# Altium schematic sheet [05] - POWER REGULATION.SchDoc
size A3; DocumentNumber: 3; SheetNumber: 3; SheetTotal: 4
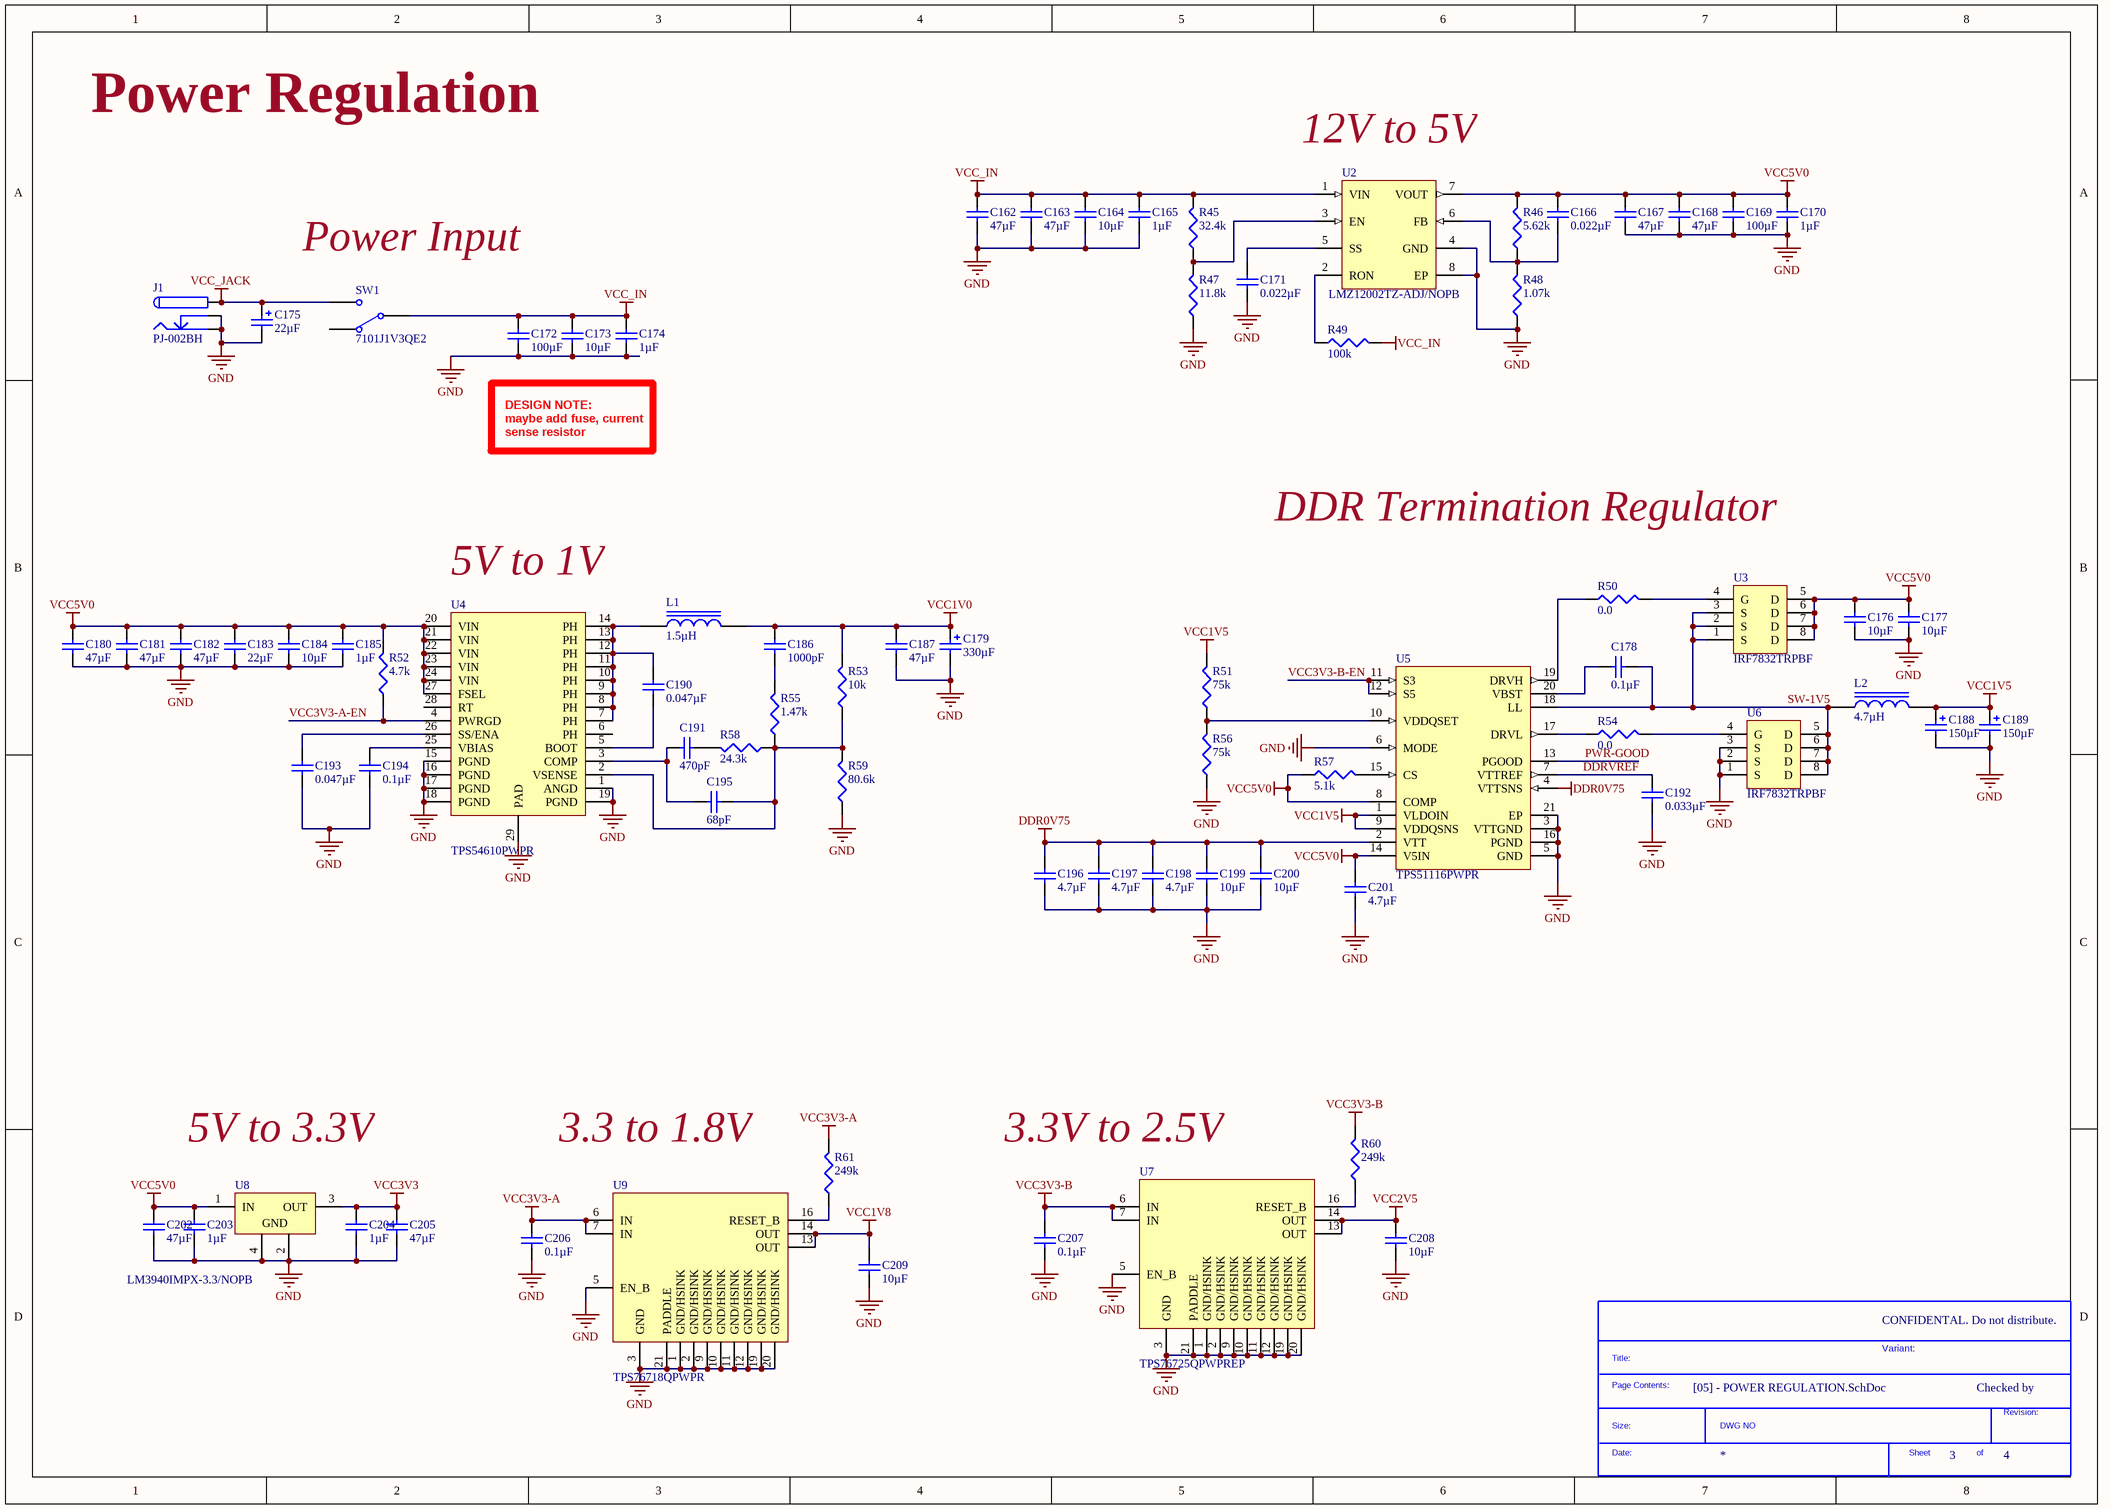
[diagram p0: [05] - POWER REGULATION.SchDoc]

## Parts
*  SDTitleBlock  (value not drawn)  (graphical)
C162  Capacitance: 47µF  [CAP-1210]  (hidden comment: GRM32ER61C476ME15L)
C163  Capacitance: 47µF  [CAP-1210]  (hidden comment: GRM32ER61C476ME15L)
C164  Capacitance: 10µF  [CAP-0805]  (hidden comment: GRM21BR61E106KA73L)
C165  Capacitance: 1µF  [CAP-0603]  (hidden comment: GRM188R71C105KA12D)
C166  Capacitance: 0.022µF  [CAP-0402]  (hidden comment: C1005X7R1E223K050BB)
C167  Capacitance: 47µF  [CAP-1210]  (hidden comment: GRM32ER61C476ME15L)
C168  Capacitance: 47µF  [CAP-1210]  (hidden comment: GRM32ER61C476ME15L)
C169  Capacitance: 100µF  [CAP-1210]  (hidden comment: GRM32EE70G107ME19L)
C170  Capacitance: 1µF  [CAP-0603]  (hidden comment: GRM188R71C105KA12D)
C171  Capacitance: 0.022µF  [CAP-0402]  (hidden comment: C1005X7R1E223K050BB)
C172  Capacitance: 100µF  [CAP-1210]  (hidden comment: GRM32EE70G107ME19L)
C173  Capacitance: 10µF  [CAP-0805]  (hidden comment: GRM21BR61E106KA73L)
C174  Capacitance: 1µF  [CAP-0603]  (hidden comment: GRM188R71C105KA12D)
C175  Capacitance: 22µF  [CAP_POL_1210]  (hidden comment: TAJB226K020RNJ)
C176  Capacitance: 10µF  [CAP-0805]  (hidden comment: GRM21BR61E106KA73L)
C177  Capacitance: 10µF  [CAP-0805]  (hidden comment: GRM21BR61E106KA73L)
C178  Capacitance: 0.1µF  [CAP-0402]  (hidden comment: CGA2B1X7R1C104K050BC)
C179  Capacitance: 330µF  [CAP_POL_2917]  (hidden comment: T530X337M010ATE004)
C180  Capacitance: 47µF  [CAP-1210]  (hidden comment: GRM32ER61C476ME15L)
C181  Capacitance: 47µF  [CAP-1210]  (hidden comment: GRM32ER61C476ME15L)
C182  Capacitance: 47µF  [CAP-1210]  (hidden comment: GRM32ER61C476ME15L)
C183  Capacitance: 22µF  [CAP-0805]  (hidden comment: GRM21BR61A226ME51L)
C184  Capacitance: 10µF  [CAP-0805]  (hidden comment: GRM21BR61E106KA73L)
C185  Capacitance: 1µF  [CAP-0603]  (hidden comment: GRM188R71C105KA12D)
C186  Capacitance: 1000pF  [CAP-0402]  (hidden comment: CGA2B2X7R1H102K050BA)
C187  Capacitance: 47µF  [CAP-1210]  (hidden comment: GRM32ER61C476ME15L)
C188  Capacitance: 150µF  (hidden comment: TCJB157M006R0070)
C189  Capacitance: 150µF  (hidden comment: TCJB157M006R0070)
C190  Capacitance: 0.047µF  [CAP-0402]  (hidden comment: CGA2B1X7R1E473K050BC)
C191  Capacitance: 470pF  [CAP-0402]  (hidden comment: CGA2B2X8R1H471K050BA)
C192  Capacitance: 0.033µF  [CAP-0402]  (hidden comment: CGA2B3X7R1H333K050BB)
C193  Capacitance: 0.047µF  [CAP-0402]  (hidden comment: CGA2B1X7R1E473K050BC)
C194  Capacitance: 0.1µF  [CAP-0402]  (hidden comment: CGA2B1X7R1C104K050BC)
C195  Capacitance: 68pF  [CAP-0402]  (hidden comment: CGA2B2C0G1H680J050BA)
C196  Capacitance: 4.7µF  [CAP-0603]  (hidden comment: GRM188R60J475KE19D)
C197  Capacitance: 4.7µF  [CAP-0603]  (hidden comment: GRM188R60J475KE19D)
C198  Capacitance: 4.7µF  [CAP-0603]  (hidden comment: GRM188R60J475KE19D)
C199  Capacitance: 10µF  [CAP-0805]  (hidden comment: GRM21BR61E106KA73L)
C200  Capacitance: 10µF  [CAP-0805]  (hidden comment: GRM21BR61E106KA73L)
C201  Capacitance: 4.7µF  [CAP-0805]  (hidden comment: CGA4J3X7R1C475K125AB)
C202  Capacitance: 47µF  [CAP-1210]  (hidden comment: GRM32ER61C476ME15L)
C203  Capacitance: 1µF  [CAP-0603]  (hidden comment: GRM188R71C105KA12D)
C204  Capacitance: 1µF  [CAP-0603]  (hidden comment: GRM188R71C105KA12D)
C205  Capacitance: 47µF  [CAP-1210]  (hidden comment: GRM32ER61C476ME15L)
C206  Capacitance: 0.1µF  [CAP-0402]  (hidden comment: CGA2B1X7R1C104K050BC)
C207  Capacitance: 0.1µF  [CAP-0402]  (hidden comment: CGA2B1X7R1C104K050BC)
C208  Capacitance: 10µF  [CAP-0805]  (hidden comment: GRM21BR61E106KA73L)
C209  Capacitance: 10µF  [CAP-0805]  (hidden comment: GRM21BR61E106KA73L)
J1  PJ-002BH  [PJ-002BH]
L1  Inductance: 1.5µH  [INDP9898X51N]  (hidden comment: SRU1048-1R5Y)
L2  Inductance: 4.7µH  [INDP9898X51N]  (hidden comment: SRU1048-4R7Y)
R45  Resistance (Ohms): 32.4k  [R0402]  (hidden comment: ERJ-2RKF3242X)
R46  Resistance (Ohms): 5.62k  [R0402]  (hidden comment: ERJ-2RKF5621X)
R47  Resistance (Ohms): 11.8k  [R0402]  (hidden comment: ERJ-2RKF1182X)
R48  Resistance (Ohms): 1.07k  [R0402]  (hidden comment: ERJ-2RKF1071X)
R49  Resistance (Ohms): 100k  [R0402]  (hidden comment: ERJ-2RKF1003X)
R50  Resistance (Ohms): 0.0  [R0402]  (hidden comment: ERJ-2GE0R00X)
R51  Resistance (Ohms): 75k  [R0402]  (hidden comment: ERJ-2RKF7502X)
R52  Resistance (Ohms): 4.7k  [R0603]  (hidden comment: ERJ-3EKF4701V)
R53  Resistance (Ohms): 10k  [R0402]  (hidden comment: RC0402FR-0710KL)
R54  Resistance (Ohms): 0.0  [R0402]  (hidden comment: ERJ-2GE0R00X)
R55  Resistance (Ohms): 1.47k  [R0402]  (hidden comment: ERA-2AEB1471X)
R56  Resistance (Ohms): 75k  [R0402]  (hidden comment: ERJ-2RKF7502X)
R57  Resistance (Ohms): 5.1k  [R0402]  (hidden comment: CRCW04025K10FKED)
R58  Resistance (Ohms): 24.3k  [R0402]  (hidden comment: ERJ-2RKF2432X)
R59  Resistance (Ohms): 80.6k  [R0402]  (hidden comment: ERA-2AEB8062X)
R60  Resistance (Ohms): 249k  [R0402]  (hidden comment: ERJ-2RKF2493X)
R61  Resistance (Ohms): 249k  [R0402]  (hidden comment: ERJ-2RKF2493X)
SW1  7101J1V3QE2  [SPDT]
U2  LMZ12002TZ-ADJ/NOPB  [TZA07A_V]
U3  IRF7832TRPBF  [SOIC127P600X175-8N]
U4  TPS54610PWPR  [TSOP65P640X120_HS-29N]
U5  TPS51116PWPR  [TSOP65P640X120_HS-21N]
U6  IRF7832TRPBF  [SOIC127P600X175-8N]
U7  TPS76725QPWPREP  [TSOP65P640X120_HS-21N]
U8  LM3940IMPX-3.3/NOPB  [SOT230P700X180-4N]
U9  TPS76718QPWPR  [TSOP65P640X120_HS-21N]

## Nets
DDR0V75: C196.1 C197.1 C198.1 C199.1 C200.1 U5.2(VTT) U5.4(VTTSNS)
GND: C162.2 C163.2 C164.2 C165.2 C167.2 C168.2 C169.2 C170.2 C171.2 C172.2 C173.2 C174.2 C175.2 C176.2 C177.2 C179.1 C180.2 C181.2 C182.2 C183.2 C184.2 C185.2 C187.2 C188.2 C189.2 C192.2 C193.2 C194.2 C196.2 C197.2 C198.2 C199.2 C200.2 C201.2 C202.1 C203.1 C204.1 C205.1 C206.2 C207.2 C208.2 C209.2 J1.2 J1.3 R47.1 R48.1 R56.1 R59.1 U2.4(GND) U2.8(EP) U4.1(ANGD) U4.15(PGND) U4.16(PGND) U4.17(PGND) U4.18(PGND) U4.19(PGND) U4.29(PAD) U5.3(VTTGND) U5.5(GND) U5.6(MODE) U5.16(PGND) U5.21(EP) U6.1(S) U6.2(S) U6.3(S) U7.1(GND/HSINK) U7.2(GND/HSINK) U7.3(GND) U7.5(EN_B) U7.9(GND/HSINK) U7.10(GND/HSINK) U7.11(GND/HSINK) U7.12(GND/HSINK) U7.19(GND/HSINK) U7.20(GND/HSINK) U7.21(PADDLE) U8.2(GND) U8.4(GND) U9.1(GND/HSINK) U9.2(GND/HSINK) U9.3(GND) U9.5(EN_B) U9.9(GND/HSINK) U9.10(GND/HSINK) U9.11(GND/HSINK) U9.12(GND/HSINK) U9.19(GND/HSINK) U9.20(GND/HSINK) U9.21(PADDLE)
VCC1V0: C179.2 C186.1 C187.1 L1.2 R53.2
VCC1V5: C188.1 C189.1 L2.2 R51.2 U5.1(VLDOIN) U5.9(VDDQSNS)
VCC1V8: C209.1 U9.13(OUT) U9.14(OUT)
VCC2V5: C208.1 U7.13(OUT) U7.14(OUT)
VCC3V3: C204.2 C205.2 U8.3(OUT)
VCC3V3-A: C206.1 R61.2 U9.6(IN) U9.7(IN)
VCC3V3-B: C207.1 R60.2 U7.6(IN) U7.7(IN)
VCC5V0: C166.1 C167.1 C168.1 C169.1 C170.1 C176.1 C177.1 C180.1 C181.1 C182.1 C183.1 C184.1 C185.1 C201.1 C202.2 C203.2 R46.2 R52.2 R57.1 U2.7(VOUT) U3.5(D) U3.6(D) U3.7(D) U3.8(D) U4.20(VIN) U4.21(VIN) U4.22(VIN) U4.23(VIN) U4.24(VIN) U4.27(FSEL) U5.8(COMP) U5.14(V5IN) U8.1(IN)
VCC_IN: C162.1 C163.1 C164.1 C165.1 C172.1 C173.1 C174.1 R45.2 R49.2 SW1.2 U2.1(VIN)
VCC_JACK: C175.1 J1.1 SW1.1
DDRVREF: C192.1 U5.7(VTTREF)
PWR-GOOD: U5.13(PGOOD)
SW-1V5: C178.1 L2.1 U3.1(S) U3.2(S) U3.3(S) U5.18(LL) U6.5(D) U6.6(D) U6.7(D) U6.8(D)
VCC3V3-A-EN: R52.1 U4.4(PWRGD)
VCC3V3-B-EN: U5.11(S3) U5.12(S5)
NetC166_2: C166.2 R46.1 R48.2 U2.6(FB)
NetC171_1: C171.1 U2.5(SS)
NetC178_2: C178.2 U5.20(VBST)
NetC186_2: C186.2 R55.2
NetC190_1: C190.1 L1.1 U4.7(PH) U4.8(PH) U4.9(PH) U4.10(PH) U4.11(PH) U4.12(PH) U4.13(PH) U4.14(PH)
NetC190_2: C190.2 U4.5(BOOT)
NetC191_1: C191.1 R58.2
NetC191_2: C191.2 C195.2 U4.3(COMP)
NetC193_1: C193.1 U4.26(SS/ENA)
NetC194_1: C194.1 U4.25(VBIAS)
NetC195_1: C195.1 R53.1 R55.1 R58.1 R59.2 U4.2(VSENSE)
NetR45_1: R45.1 R47.2 U2.3(EN)
NetR49_1: R49.1 U2.2(RON)
NetR50_1: R50.1 U5.19(DRVH)
NetR50_2: R50.2 U3.4(G)
NetR51_1: R51.1 R56.2 U5.10(VDDQSET)
NetR54_1: R54.1 U5.17(DRVL)
NetR54_2: R54.2 U6.4(G)
NetR57_2: R57.2 U5.15(CS)
NetR60_1: R60.1 U7.16(RESET_B)
NetR61_1: R61.1 U9.16(RESET_B)

Not connected (* = marked no-connect by the designer): SW1 3; U4 6(PH) 28(RT)

## Notes on the sheet
- Power Regulation
- 12V to 5V
- (near SW1) Power Input
- DESIGN NOTE:
  maybe add fuse, current sense resistor
- 5V to 1V
- DDR Termination Regulator
- 5V to 3.3V
- (near R61) 3.3 to 1.8V
- 3.3V to 2.5V
- CONFIDENTAL. Do not distribute.
- Variant:
- Checked by
- (in symbol SDTitleBlock) Title:; Page Contents:; Revision:; Size:; DWG NO; Date:; Sheet; of

## Library data of the parts
C162 C163 C167 C168 C180-C182 C187 C202 C205 = GRM32ER61C476ME15L: CAP CER 47UF 16V X5R 1210; Manufacturer: Murata Electronics North America; Tolerance: ±20%; Supplier 1: Digi-Key; Manufacturer Part Number: GRM32ER61C476ME15L; RoHS: RoHS Compliant; Category: Capacitors; Stock 1: 466196; Pricing 1: 1=0.94, 10=0.795, 50=0.585, 100=0.465, 250=0.39, 500=0.3525 (USD); Packaging: Cut Tape (CT); Voltage - Rated: 16V; Temperature Coefficient: X5R; Mounting Type: Surface Mount, MLCC; Operating Temperature: -55°C ~ 85°C; Applications: General Purpose; Ratings: -; Package / Case: 1210 (3225 Metric); Size / Dimension: 0.126" L x 0.098" W (3.20mm x 2.50mm); Height - Seated (Max): -; Thickness (Max): 0.106" (2.70mm); Lead Spacing: -; Features: -; Lead Style: -; ComponentLink1URL: http://www.murata.com/~/media/webrenewal/support/library/catalog/products/capacitor/mlcc/c02e.pdf; ComponentLink1Description: http://www.murata.com/~/media/webrenewal/support/library/catalog/products/capacitor/mlcc/c02e.pdf; Supplier Part Number 1: 490-3888-1-ND
C164 C173 C176 C177 C184 C199 C200 C208 C209 = GRM21BR61E106KA73L: CAP CER 10UF 25V X5R 0805; Manufacturer: Murata Electronics North America; Tolerance: ±10%; Supplier 1: Digi-Key; Manufacturer Part Number: GRM21BR61E106KA73L; RoHS: RoHS Compliant; Category: Capacitors; Stock 1: 242003; Pricing 1: 1=0.2, 10=0.136, 50=0.0826, 100=0.0693 (USD); Packaging: Cut Tape (CT); Voltage - Rated: 25V; Temperature Coefficient: X5R; Mounting Type: Surface Mount, MLCC; Operating Temperature: -55°C ~ 85°C; Applications: General Purpose; Ratings: -; Package / Case: 0805 (2012 Metric); Size / Dimension: 0.079" L x 0.049" W (2.00mm x 1.25mm); Height - Seated (Max): -; Thickness (Max): 0.053" (1.35mm); Lead Spacing: -; Features: -; Lead Style: -; ComponentLink1URL: http://www.murata.com/~/media/webrenewal/support/library/catalog/products/capacitor/mlcc/c02e.pdf; ComponentLink1Description: http://www.murata.com/~/media/webrenewal/support/library/catalog/products/capacitor/mlcc/c02e.pdf; Supplier Part Number 1: 490-5523-1-ND
C165 C170 C174 C185 C203 C204 = GRM188R71C105KA12D: CAP CER 1UF 16V X7R 0603; Manufacturer: Murata Electronics North America; Tolerance: ±10%; Supplier 1: Digi-Key; Manufacturer Part Number: GRM188R71C105KA12D; RoHS: RoHS Compliant; Category: Capacitors; Stock 1: 819049; Pricing 1: 1=0.1, 10=0.073, 50=0.0396, 100=0.0336, 250=0.02744, 500=0.02348, 1000=0.0183 (USD); Packaging: Cut Tape (CT); Voltage - Rated: 16V; Temperature Coefficient: X7R; Mounting Type: Surface Mount, MLCC; Operating Temperature: -55°C ~ 125°C; Applications: General Purpose; Ratings: -; Package / Case: 0603 (1608 Metric); Size / Dimension: 0.063" L x 0.031" W (1.60mm x 0.80mm); Height - Seated (Max): -; Thickness (Max): 0.035" (0.90mm); Lead Spacing: -; Features: -; Lead Style: -; ComponentLink1URL: http://www.murata.com/~/media/webrenewal/support/library/catalog/products/capacitor/mlcc/c02e.pdf; ComponentLink1Description: http://www.murata.com/~/media/webrenewal/support/library/catalog/products/capacitor/mlcc/c02e.pdf; Supplier Part Number 1: 490-3900-1-ND
C166 C171 = C1005X7R1E223K050BB: CAP CER 0.022UF 25V X7R 0402; Manufacturer: TDK Corporation; Tolerance: ±10%; Supplier 1: Digi-Key; Manufacturer Part Number: C1005X7R1E223K050BB; RoHS: RoHS Compliant; Category: Capacitors; Stock 1: 573981; Pricing 1: 1=0.1, 10=0.032, 100=0.0149, 250=0.01216, 500=0.0104, 1000=0.0081, 5000=0.00675 (USD); Packaging: Cut Tape (CT); Voltage - Rated: 25V; Temperature Coefficient: X7R; Mounting Type: Surface Mount, MLCC; Operating Temperature: -55°C ~ 125°C; Applications: General Purpose; Ratings: -; Package / Case: 0402 (1005 Metric); Size / Dimension: 0.039" L x 0.020" W (1.00mm x 0.50mm); Height - Seated (Max): -; Thickness (Max): 0.022" (0.55mm); Lead Spacing: -; Features: -; Lead Style: -; ComponentLink1URL: https://product.tdk.com/info/en/catalog/datasheets/mlcc_commercial_general_en.pdf; ComponentLink1Description: https://product.tdk.com/info/en/catalog/datasheets/mlcc_commercial_general_en.pdf; Supplier Part Number 1: 445-1261-1-ND
C169 C172 = GRM32EE70G107ME19L: CAP CER 100UF 4V X7U 1210; Manufacturer: Murata Electronics North America; Tolerance: ±20%; Supplier 1: Digi-Key; Manufacturer Part Number: GRM32EE70G107ME19L; RoHS: RoHS Compliant; Category: Capacitors; Stock 1: 21753; Pricing 1: 1=1.45, 10=1.189, 50=1.0444, 100=0.8413, 250=0.69624, 500=0.62372 (USD); Packaging: Cut Tape (CT); Voltage - Rated: 4V; Temperature Coefficient: X7U; Mounting Type: Surface Mount, MLCC; Operating Temperature: -55°C ~ 125°C; Applications: General Purpose; Ratings: -; Package / Case: 1210 (3225 Metric); Size / Dimension: 0.126" L x 0.098" W (3.20mm x 2.50mm); Height - Seated (Max): -; Thickness (Max): 0.106" (2.70mm); Lead Spacing: -; Features: -; Lead Style: -; ComponentLink1URL: http://www.murata.com/~/media/webrenewal/support/library/catalog/products/capacitor/mlcc/c02e.pdf; ComponentLink1Description: http://www.murata.com/~/media/webrenewal/support/library/catalog/products/capacitor/mlcc/c02e.pdf; Supplier Part Number 1: 490-6534-1-ND
C175 = TAJB226K020RNJ: CAP TANT 22UF 20V 10% 1210; Manufacturer: AVX Corporation; Manufacturer Size Code: B; ESR (Equivalent Series Resistance): 1.8 Ohm; Type: Molded; Supplier 1: Digi-Key; Manufacturer Part Number: TAJB226K020RNJ; RoHS: RoHS Compliant; Category: Capacitors; Stock 1: 649792; Pricing 1: 1=0.88, 10=0.838, 100=0.4063, 250=0.33752, 500=0.30626, 1000=0.28125 (USD); Packaging: Cut Tape (CT); Tolerance: ±10%; Voltage - Rated: 20V; Operating Temperature: -55°C ~ 125°C; Mounting Type: Surface Mount; Package / Case: 1210 (3528 Metric); Size / Dimension: 0.138" L x 0.110" W (3.50mm x 2.80mm); Height - Seated (Max): 0.083" (2.10mm); Lead Spacing: -; Features: General Purpose; Lifetime @ Temp.: -; ComponentLink1URL: http://datasheets.avx.com/TAJ.pdf; ComponentLink1Description: http://datasheets.avx.com/TAJ.pdf; Supplier Part Number 1: 478-1683-1-ND
C178 C194 C206 C207 = CGA2B1X7R1C104K050BC: CAP CER 0.1UF 16V X7R 0402; Manufacturer: TDK Corporation; Tolerance: ±10%; Supplier 1: Digi-Key; Manufacturer Part Number: CGA2B1X7R1C104K050BC; RoHS: RoHS Compliant; Category: Capacitors; Stock 1: 413079; Pricing 1: 1=0.1, 10=0.042, 100=0.0193, 250=0.01576, 500=0.01348, 1000=0.0105, 5000=0.00875 (USD); Packaging: Cut Tape (CT); Voltage - Rated: 16V; Temperature Coefficient: X7R; Mounting Type: Surface Mount, MLCC; Operating Temperature: -55°C ~ 125°C; Applications: Automotive; Ratings: AEC-Q200; Package / Case: 0402 (1005 Metric); Size / Dimension: 0.039" L x 0.020" W (1.00mm x 0.50mm); Height - Seated (Max): -; Thickness (Max): 0.022" (0.55mm); Lead Spacing: -; Features: -; Lead Style: -; ComponentLink1URL: https://product.tdk.com/info/en/catalog/datasheets/mlcc_automotive_general_en.pdf; ComponentLink1Description: https://product.tdk.com/info/en/catalog/datasheets/mlcc_automotive_general_en.pdf; Supplier Part Number 1: 445-5613-1-ND
C179 = T530X337M010ATE004: CAP TANT POLY 330UF 10V 2917; Manufacturer: Kemet; Manufacturer Size Code: X; Tolerance: ±20%; ESR (Equivalent Series Resistance): 4 mOhm; Type: Molded; Lifetime @ Temp.: 2000 Hrs @ 105°C; Supplier 1: Digi-Key; Manufacturer Part Number: T530X337M010ATE004; RoHS: RoHS Compliant; Category: Capacitors; Stock 1: 1250; Pricing 1: 1=8.22, 10=7.685, 50=7.2876, 100=6.625, 250=5.69752 (USD); Packaging: Cut Tape (CT); Voltage - Rated: 10V; Operating Temperature: -55°C ~ 125°C; Mounting Type: Surface Mount; Package / Case: 2917 (7343 Metric); Size / Dimension: 0.287" L x 0.169" W (7.30mm x 4.30mm); Height - Seated (Max): 0.169" (4.30mm); Lead Spacing: -; Features: General Purpose; ComponentLink1URL: http://www.kemet.com/docfinder?Partnumber=T530X337M010ATE004; ComponentLink1Description: http://www.kemet.com/docfinder?Partnumber=T530X337M010ATE004; Supplier Part Number 1: 399-10378-1-ND
C183 = GRM21BR61A226ME51L: CAP CER 22UF 10V X5R 0805; Manufacturer: Murata Electronics North America; Tolerance: ±20%; Supplier 1: Digi-Key; Manufacturer Part Number: GRM21BR61A226ME51L; RoHS: RoHS Compliant; Category: Capacitors; Stock 1: 37482; Pricing 1: 1=0.26, 10=0.214, 25=0.1468, 50=0.1202, 100=0.1068, 250=0.08012, 500=0.07076, 1000=0.06275 (USD); Packaging: Cut Tape (CT); Voltage - Rated: 10V; Temperature Coefficient: X5R; Mounting Type: Surface Mount, MLCC; Operating Temperature: -55°C ~ 85°C; Applications: General Purpose; Ratings: -; Package / Case: 0805 (2012 Metric); Size / Dimension: 0.079" L x 0.049" W (2.00mm x 1.25mm); Height - Seated (Max): -; Thickness (Max): 0.055" (1.40mm); Lead Spacing: -; Features: Derating Recommended; Lead Style: -; ComponentLink1URL: http://www.murata.com/~/media/webrenewal/support/library/catalog/products/capacitor/mlcc/c02e.pdf; ComponentLink1Description: http://www.murata.com/~/media/webrenewal/support/library/catalog/products/capacitor/mlcc/c02e.pdf; Supplier Part Number 1: 490-10511-1-ND
C186 = CGA2B2X7R1H102K050BA: CAP CER 1000PF 50V X7R 0402; Manufacturer: TDK Corporation; Tolerance: ±10%; Supplier 1: Digi-Key; Manufacturer Part Number: CGA2B2X7R1H102K050BA; RoHS: RoHS Compliant; Category: Capacitors; Stock 1: 65364; Pricing 1: 1=0.1, 10=0.031, 100=0.0143, 250=0.01172, 500=0.01002, 1000=0.0078, 5000=0.0065 (USD); Packaging: Cut Tape (CT); Voltage - Rated: 50V; Temperature Coefficient: X7R; Mounting Type: Surface Mount, MLCC; Operating Temperature: -55°C ~ 125°C; Applications: Automotive; Ratings: AEC-Q200; Package / Case: 0402 (1005 Metric); Size / Dimension: 0.039" L x 0.020" W (1.00mm x 0.50mm); Height - Seated (Max): -; Thickness (Max): 0.022" (0.55mm); Lead Spacing: -; Features: -; Lead Style: -; ComponentLink1URL: https://product.tdk.com/info/en/catalog/datasheets/mlcc_automotive_general_en.pdf; ComponentLink1Description: https://product.tdk.com/info/en/catalog/datasheets/mlcc_automotive_general_en.pdf; Supplier Part Number 1: 445-5605-1-ND
C188 C189 = TCJB157M006R0070: CAP TANT POLY 150UF 6.3V 1210; Manufacturer: AVX Corporation; Manufacturer Size Code: B; Tolerance: ±20%; ESR (Equivalent Series Resistance): 70 mOhm; Type: Molded; Supplier 1: Digi-Key; Manufacturer Part Number: TCJB157M006R0070; RoHS: RoHS Compliant; Category: Capacitors; Stock 1: 9013; Pricing 1: 1=2.48, 10=2.03, 100=1.4355, 250=1.188, 500=1.06426, 1000=0.9405 (USD); Packaging: Cut Tape (CT); Voltage - Rated: 6.3V; Operating Temperature: -55°C ~ 105°C; Mounting Type: Surface Mount; Package / Case: 1210 (3528 Metric); Size / Dimension: 0.138" L x 0.110" W (3.50mm x 2.80mm); Height - Seated (Max): 0.083" (2.10mm); Lead Spacing: -; Features: Polymer; Lifetime @ Temp.: -; ComponentLink1URL: http://datasheets.avx.com/TCJ.pdf; ComponentLink1Description: http://datasheets.avx.com/TCJ.pdf; Supplier Part Number 1: 478-4921-1-ND
C190 C193 = CGA2B1X7R1E473K050BC: CAP CER 0.047UF 25V X7R 0402; Manufacturer: TDK Corporation; Tolerance: ±10%; Supplier 1: Digi-Key; Manufacturer Part Number: CGA2B1X7R1E473K050BC; RoHS: RoHS Compliant; Category: Capacitors; Stock 1: 23190; Pricing 1: 1=0.1, 10=0.048, 100=0.022, 250=0.018, 500=0.0154, 1000=0.012, 5000=0.01 (USD); Packaging: Cut Tape (CT); Voltage - Rated: 25V; Temperature Coefficient: X7R; Mounting Type: Surface Mount, MLCC; Operating Temperature: -55°C ~ 125°C; Applications: Automotive; Ratings: AEC-Q200; Package / Case: 0402 (1005 Metric); Size / Dimension: 0.039" L x 0.020" W (1.00mm x 0.50mm); Height - Seated (Max): -; Thickness (Max): 0.022" (0.55mm); Lead Spacing: -; Features: -; Lead Style: -; ComponentLink1URL: https://product.tdk.com/info/en/catalog/datasheets/mlcc_automotive_general_en.pdf; ComponentLink1Description: https://product.tdk.com/info/en/catalog/datasheets/mlcc_automotive_general_en.pdf; Supplier Part Number 1: 445-5610-1-ND
C191 = CGA2B2X8R1H471K050BA: CAP CER 470PF 50V X8R 0402; Manufacturer: TDK Corporation; Tolerance: ±10%; Supplier 1: Digi-Key; Manufacturer Part Number: CGA2B2X8R1H471K050BA; RoHS: RoHS Compliant; Category: Capacitors; Stock 1: 6403; Pricing 1: 1=0.16, 10=0.11, 100=0.0523, 250=0.044, 500=0.03686, 1000=0.03025, 5000=0.02558 (USD); Packaging: Cut Tape (CT); Voltage - Rated: 50V; Temperature Coefficient: X8R; Mounting Type: Surface Mount, MLCC; Operating Temperature: -55°C ~ 150°C; Applications: Automotive; Ratings: AEC-Q200; Package / Case: 0402 (1005 Metric); Size / Dimension: 0.039" L x 0.020" W (1.00mm x 0.50mm); Height - Seated (Max): -; Thickness (Max): 0.022" (0.55mm); Lead Spacing: -; Features: High Temperature; Lead Style: -; ComponentLink1URL: https://product.tdk.com/info/en/catalog/datasheets/mlcc_automotive_hightemp_en.pdf; ComponentLink1Description: https://product.tdk.com/info/en/catalog/datasheets/mlcc_automotive_hightemp_en.pdf; Supplier Part Number 1: 445-5877-1-ND
C192 = CGA2B3X7R1H333K050BB: CAP CER 0.033UF 50V X7R 0402; Manufacturer: TDK Corporation; Tolerance: ±10%; Supplier 1: Digi-Key; Manufacturer Part Number: CGA2B3X7R1H333K050BB; RoHS: RoHS Compliant; Category: Capacitors; Stock 1: 91186; Pricing 1: 1=0.11, 10=0.078, 100=0.0358, 250=0.02924, 500=0.02502, 1000=0.0195, 5000=0.01625 (USD); Packaging: Cut Tape (CT); Voltage - Rated: 50V; Temperature Coefficient: X7R; Mounting Type: Surface Mount, MLCC; Operating Temperature: -55°C ~ 125°C; Applications: Automotive; Ratings: AEC-Q200; Package / Case: 0402 (1005 Metric); Size / Dimension: 0.039" L x 0.020" W (1.00mm x 0.50mm); Height - Seated (Max): -; Thickness (Max): 0.022" (0.55mm); Lead Spacing: -; Features: -; Lead Style: -; ComponentLink1URL: https://product.tdk.com/info/en/catalog/datasheets/mlcc_automotive_general_en.pdf; ComponentLink1Description: https://product.tdk.com/info/en/catalog/datasheets/mlcc_automotive_general_en.pdf; Supplier Part Number 1: 445-6896-1-ND
C195 = CGA2B2C0G1H680J050BA: CAP CER 68PF 50V C0G 0402; Manufacturer: TDK Corporation; Tolerance: ±5%; Temperature Coefficient: C0G, NP0; Supplier 1: Digi-Key; Manufacturer Part Number: CGA2B2C0G1H680J050BA; RoHS: RoHS Compliant; Category: Capacitors; Stock 1: 33658; Pricing 1: 1=0.1, 10=0.054, 100=0.0248, 250=0.02024, 500=0.01732, 1000=0.0135, 5000=0.01125 (USD); Packaging: Cut Tape (CT); Voltage - Rated: 50V; Mounting Type: Surface Mount, MLCC; Operating Temperature: -55°C ~ 125°C; Applications: Automotive; Ratings: AEC-Q200; Package / Case: 0402 (1005 Metric); Size / Dimension: 0.039" L x 0.020" W (1.00mm x 0.50mm); Height - Seated (Max): -; Thickness (Max): 0.022" (0.55mm); Lead Spacing: -; Features: -; Lead Style: -; ComponentLink1URL: https://product.tdk.com/info/en/catalog/datasheets/mlcc_automotive_general_en.pdf; ComponentLink1Description: https://product.tdk.com/info/en/catalog/datasheets/mlcc_automotive_general_en.pdf; Supplier Part Number 1: 445-5594-1-ND
C196-C198 = GRM188R60J475KE19D: CAP CER 4.7UF 6.3V X5R 0603; Manufacturer: Murata Electronics North America; Tolerance: ±10%; Supplier 1: Digi-Key; Manufacturer Part Number: GRM188R60J475KE19D; RoHS: RoHS Compliant; Category: Capacitors; Stock 1: 670646; Pricing 1: 1=0.12, 10=0.08, 50=0.046, 100=0.038, 250=0.032, 500=0.0268, 1000=0.022 (USD); Packaging: Cut Tape (CT); Voltage - Rated: 6.3V; Temperature Coefficient: X5R; Mounting Type: Surface Mount, MLCC; Operating Temperature: -55°C ~ 85°C; Applications: General Purpose; Ratings: -; Package / Case: 0603 (1608 Metric); Size / Dimension: 0.063" L x 0.031" W (1.60mm x 0.80mm); Height - Seated (Max): -; Thickness (Max): 0.035" (0.90mm); Lead Spacing: -; Features: -; Lead Style: -; ComponentLink1URL: http://www.murata.com/~/media/webrenewal/support/library/catalog/products/capacitor/mlcc/c02e.pdf; ComponentLink1Description: http://www.murata.com/~/media/webrenewal/support/library/catalog/products/capacitor/mlcc/c02e.pdf; Supplier Part Number 1: 490-3297-1-ND
C201 = CGA4J3X7R1C475K125AB: CAP CER 4.7UF 16V X7R 0805; Manufacturer: TDK Corporation; Tolerance: ±10%; Supplier 1: Digi-Key; Manufacturer Part Number: CGA4J3X7R1C475K125AB; RoHS: RoHS Compliant; Category: Capacitors; Stock 1: 19586; Pricing 1: 1=0.34, 10=0.294, 100=0.147, 250=0.1176, 500=0.1071, 1000=0.0966 (USD); Packaging: Cut Tape (CT); Voltage - Rated: 16V; Temperature Coefficient: X7R; Mounting Type: Surface Mount, MLCC; Operating Temperature: -55°C ~ 125°C; Applications: Automotive; Ratings: AEC-Q200; Package / Case: 0805 (2012 Metric); Size / Dimension: 0.079" L x 0.049" W (2.00mm x 1.25mm); Height - Seated (Max): -; Thickness (Max): 0.057" (1.45mm); Lead Spacing: -; Features: -; Lead Style: -; ComponentLink1URL: https://product.tdk.com/info/en/catalog/datasheets/mlcc_automotive_general_en.pdf; ComponentLink1Description: https://product.tdk.com/info/en/catalog/datasheets/mlcc_automotive_general_en.pdf; Supplier Part Number 1: 445-6969-1-ND
J1 = PJ-002BH: CONN PWR JACK 2.5X5.5MM HIGH CUR; Manufacturer: CUI Inc.; Gender: Male; Plug/Mating Plug Diameter: 2.5mm ID, 5.5mm OD; Number of Positions/Contacts: 2 Conductors, 3 Contacts; Internal Switch(s): Single Switch, Normally Closed; Shielding: Unshielded; Voltage - Rated: 24VDC; Current Rating: 5A; Supplier 1: Digi-Key; Manufacturer Part Number: PJ-002BH; RoHS: RoHS Compliant; Category: Connectors, Interconnects; Stock 1: 59401; Pricing 1: 1=1.16, 10=0.812, 100=0.5452, 500=0.4408, 1000=0.3944, 2500=0.3132 (USD); Connector Type: Jack; Mounting Type: Through Hole, Right Angle; Termination: Solder Eyelet(s); Features: -; Color: Black; Contact Material: Copper Alloy; Contact Material - Plating: Nickel; Housing Color: Black; Housing Material: Thermoplastic; Operating Temperature: -25°C ~ 85°C; ComponentLink1URL: http://www.cui.com/product/resource/digikeypdf/pj-002bh.pdf; ComponentLink1Description: http://www.cui.com/product/resource/digikeypdf/pj-002bh.pdf; Supplier Part Number 1: CP-002BH-ND
L1 = SRU1048-1R5Y: FIXED IND 1.5UH 7A 4.3 MOHM SMD; Manufacturer: Bourns Inc.; Type: Wirewound; Material - Core: Ferrite; Tolerance: ±30%; Current - Saturation: 7.2A; Shielding: Shielded; Q @ Freq: 14 @ 7.96MHz; Frequency - Self Resonant: 70MHz; Frequency - Test: 100kHz; Supplier 1: Digi-Key; Manufacturer Part Number: SRU1048-1R5Y; RoHS: RoHS Compliant; Category: Inductors, Coils, Chokes; Stock 1: 1754; Pricing 1: 1=0.8, 10=0.75, 25=0.7, 50=0.6, 100=0.57, 250=0.52 (USD); Packaging: Cut Tape (CT); Current Rating: 7A; DC Resistance (DCR): 4.3 mOhm; Ratings: -; Operating Temperature: -40°C ~ 125°C; Mounting Type: Surface Mount; Package / Case: Nonstandard; Size / Dimension: 0.394" L x 0.394" W (10.00mm x 10.00mm); Height - Seated (Max): 0.201" (5.10mm); ComponentLink1URL: http://www.bourns.com/docs/Product-Datasheets/SRU1048.pdf; ComponentLink1Description: http://www.bourns.com/docs/Product-Datasheets/SRU1048.pdf; Supplier Part Number 1: SRU1048-1R5YCT-ND
L2 = SRU1048-4R7Y: FIXED IND 4.7UH 5.5A 9.5 MOHM; Manufacturer: Bourns Inc.; Type: Wirewound; Material - Core: Ferrite; Tolerance: ±30%; Current - Saturation: 4.75A; Shielding: Shielded; Q @ Freq: 12 @ 7.96MHz; Frequency - Self Resonant: 30MHz; Frequency - Test: 100kHz; Supplier 1: Digi-Key; Manufacturer Part Number: SRU1048-4R7Y; RoHS: RoHS Compliant; Category: Inductors, Coils, Chokes; Stock 1: 6353; Pricing 1: 1=0.8, 10=0.75, 25=0.7, 50=0.6, 100=0.57, 250=0.52 (USD); Packaging: Cut Tape (CT); Current Rating: 5.5A; DC Resistance (DCR): 9.5 mOhm; Ratings: -; Operating Temperature: -40°C ~ 125°C; Mounting Type: Surface Mount; Package / Case: Nonstandard; Size / Dimension: 0.394" L x 0.394" W (10.00mm x 10.00mm); Height - Seated (Max): 0.201" (5.10mm); ComponentLink1URL: http://www.bourns.com/docs/Product-Datasheets/SRU1048.pdf; ComponentLink1Description: http://www.bourns.com/docs/Product-Datasheets/SRU1048.pdf; Supplier Part Number 1: SRU1048-4R7YCT-ND
R45 = ERJ-2RKF3242X: RES SMD 32.4K OHM 1% 1/10W 0402; Manufacturer: Panasonic Electronic Components; Power (Watts): 0.1W, 1/10W; Temperature Coefficient: ±100ppm/°C; Supplier 1: Digi-Key; Manufacturer Part Number: ERJ-2RKF3242X; RoHS: RoHS Compliant; Category: Resistors; Stock 1: 475552; Pricing 1: 1=0.1, 50=0.015, 100=0.011, 250=0.0084, 500=0.00674, 1000=0.00496, 5000=0.00355 (USD); Packaging: Cut Tape (CT); Tolerance: ±1%; Composition: Thick Film; Features: Automotive AEC-Q200; Operating Temperature: -55°C ~ 155°C; Package / Case: 0402 (1005 Metric); Supplier Device Package: 0402; Size / Dimension: 0.039" L x 0.020" W (1.00mm x 0.50mm); Height: 0.016" (0.40mm); Number of Terminations: 2; ComponentLink1URL: http://industrial.panasonic.com/www-cgi/jvcr13pz.cgi?E+PZ+3+AOA0002+ERJ2RKF3242X+7+WW; ComponentLink1Description: http://industrial.panasonic.com/www-cgi/jvcr13pz.cgi?E+PZ+3+AOA0002+ERJ2RKF3242X+7+WW; Supplier Part Number 1: P32.4KLCT-ND
R46 = ERJ-2RKF5621X: RES SMD 5.62K OHM 1% 1/10W 0402; Manufacturer: Panasonic Electronic Components; Power (Watts): 0.1W, 1/10W; Temperature Coefficient: ±100ppm/°C; Supplier 1: Digi-Key; Manufacturer Part Number: ERJ-2RKF5621X; RoHS: RoHS Compliant; Category: Resistors; Stock 1: 152211; Pricing 1: 1=0.1, 50=0.015, 100=0.011, 250=0.0084, 500=0.00674, 1000=0.00496, 5000=0.00355 (USD); Packaging: Cut Tape (CT); Tolerance: ±1%; Composition: Thick Film; Features: Automotive AEC-Q200; Operating Temperature: -55°C ~ 155°C; Package / Case: 0402 (1005 Metric); Supplier Device Package: 0402; Size / Dimension: 0.039" L x 0.020" W (1.00mm x 0.50mm); Height: 0.016" (0.40mm); Number of Terminations: 2; ComponentLink1URL: http://industrial.panasonic.com/www-cgi/jvcr13pz.cgi?E+PZ+3+AOA0002+ERJ2RKF5621X+7+WW; ComponentLink1Description: http://industrial.panasonic.com/www-cgi/jvcr13pz.cgi?E+PZ+3+AOA0002+ERJ2RKF5621X+7+WW; Supplier Part Number 1: P5.62KLCT-ND
R47 = ERJ-2RKF1182X: RES SMD 11.8K OHM 1% 1/10W 0402; Manufacturer: Panasonic Electronic Components; Power (Watts): 0.1W, 1/10W; Temperature Coefficient: ±100ppm/°C; Supplier 1: Digi-Key; Manufacturer Part Number: ERJ-2RKF1182X; RoHS: RoHS Compliant; Category: Resistors; Stock 1: 173629; Pricing 1: 1=0.1, 50=0.015, 100=0.011, 250=0.0084, 500=0.00674, 1000=0.00496, 5000=0.00355 (USD); Packaging: Cut Tape (CT); Tolerance: ±1%; Composition: Thick Film; Features: Automotive AEC-Q200; Operating Temperature: -55°C ~ 155°C; Package / Case: 0402 (1005 Metric); Supplier Device Package: 0402; Size / Dimension: 0.039" L x 0.020" W (1.00mm x 0.50mm); Height: 0.016" (0.40mm); Number of Terminations: 2; ComponentLink1URL: http://industrial.panasonic.com/www-cgi/jvcr13pz.cgi?E+PZ+3+AOA0002+ERJ2RKF1182X+7+WW; ComponentLink1Description: http://industrial.panasonic.com/www-cgi/jvcr13pz.cgi?E+PZ+3+AOA0002+ERJ2RKF1182X+7+WW; Supplier Part Number 1: P11.8KLCT-ND
R48 = ERJ-2RKF1071X: RES SMD 1.07K OHM 1% 1/10W 0402; Manufacturer: Panasonic Electronic Components; Power (Watts): 0.1W, 1/10W; Temperature Coefficient: ±100ppm/°C; Supplier 1: Digi-Key; Manufacturer Part Number: ERJ-2RKF1071X; RoHS: RoHS Compliant; Category: Resistors; Stock 1: 117486; Pricing 1: 1=0.1, 50=0.015, 100=0.011, 250=0.0084, 500=0.00674, 1000=0.00496, 5000=0.00355 (USD); Packaging: Cut Tape (CT); Tolerance: ±1%; Composition: Thick Film; Features: Automotive AEC-Q200; Operating Temperature: -55°C ~ 155°C; Package / Case: 0402 (1005 Metric); Supplier Device Package: 0402; Size / Dimension: 0.039" L x 0.020" W (1.00mm x 0.50mm); Height: 0.016" (0.40mm); Number of Terminations: 2; ComponentLink1URL: http://industrial.panasonic.com/www-cgi/jvcr13pz.cgi?E+PZ+3+AOA0002+ERJ2RKF1071X+7+WW; ComponentLink1Description: http://industrial.panasonic.com/www-cgi/jvcr13pz.cgi?E+PZ+3+AOA0002+ERJ2RKF1071X+7+WW; Supplier Part Number 1: P1.07KLCT-ND
R49 = ERJ-2RKF1003X: RES SMD 100K OHM 1% 1/10W 0402; Manufacturer: Panasonic Electronic Components; Power (Watts): 0.1W, 1/10W; Temperature Coefficient: ±100ppm/°C; Supplier 1: Digi-Key; Manufacturer Part Number: ERJ-2RKF1003X; RoHS: RoHS Compliant; Category: Resistors; Stock 1: 7715879; Pricing 1: 1=0.1, 50=0.015, 100=0.011, 250=0.0084, 500=0.00674, 1000=0.00496, 5000=0.00355 (USD); Packaging: Cut Tape (CT); Tolerance: ±1%; Composition: Thick Film; Features: Automotive AEC-Q200; Operating Temperature: -55°C ~ 155°C; Package / Case: 0402 (1005 Metric); Supplier Device Package: 0402; Size / Dimension: 0.039" L x 0.020" W (1.00mm x 0.50mm); Height: 0.016" (0.40mm); Number of Terminations: 2; ComponentLink1URL: http://industrial.panasonic.com/www-cgi/jvcr13pz.cgi?E+PZ+3+AOA0002+ERJ2RKF1003X+7+WW; ComponentLink1Description: http://industrial.panasonic.com/www-cgi/jvcr13pz.cgi?E+PZ+3+AOA0002+ERJ2RKF1003X+7+WW; Supplier Part Number 1: P100KLCT-ND
R50 R54 = ERJ-2GE0R00X: RES SMD 0.0OHM JUMPER 1/10W 0402; Manufacturer: Panasonic Electronic Components; Power (Watts): 0.1W, 1/10W; Supplier 1: Digi-Key; Manufacturer Part Number: ERJ-2GE0R00X; RoHS: RoHS Compliant; Category: Resistors; Stock 1: 13183757; Pricing 1: 1=0.1, 50=0.0138, 100=0.0105, 250=0.0078, 500=0.00576, 1000=0.00384, 5000=0.0027 (USD); Packaging: Cut Tape (CT); Tolerance: Jumper; Composition: Thick Film; Features: Automotive AEC-Q200; Temperature Coefficient: -; Operating Temperature: -55°C ~ 155°C; Package / Case: 0402 (1005 Metric); Supplier Device Package: 0402; Size / Dimension: 0.039" L x 0.020" W (1.00mm x 0.50mm); Height: 0.016" (0.40mm); Number of Terminations: 2; ComponentLink1URL: http://industrial.panasonic.com/www-cgi/jvcr13pz.cgi?E+PZ+3+AOA0001+ERJ2GE0R00X+7+WW; ComponentLink1Description: http://industrial.panasonic.com/www-cgi/jvcr13pz.cgi?E+PZ+3+AOA0001+ERJ2GE0R00X+7+WW; Supplier Part Number 1: P0.0JCT-ND
R51 R56 = ERJ-2RKF7502X: RES SMD 75K OHM 1% 1/10W 0402; Manufacturer: Panasonic Electronic Components; Power (Watts): 0.1W, 1/10W; Temperature Coefficient: ±100ppm/°C; Supplier 1: Digi-Key; Manufacturer Part Number: ERJ-2RKF7502X; RoHS: RoHS Compliant; Category: Resistors; Stock 1: 516118; Pricing 1: 1=0.1, 50=0.015, 100=0.011, 250=0.0084, 500=0.00674, 1000=0.00496, 5000=0.00355 (USD); Packaging: Cut Tape (CT); Tolerance: ±1%; Composition: Thick Film; Features: Automotive AEC-Q200; Operating Temperature: -55°C ~ 155°C; Package / Case: 0402 (1005 Metric); Supplier Device Package: 0402; Size / Dimension: 0.039" L x 0.020" W (1.00mm x 0.50mm); Height: 0.016" (0.40mm); Number of Terminations: 2; ComponentLink1URL: http://industrial.panasonic.com/www-cgi/jvcr13pz.cgi?E+PZ+3+AOA0002+ERJ2RKF7502X+7+WW; ComponentLink1Description: http://industrial.panasonic.com/www-cgi/jvcr13pz.cgi?E+PZ+3+AOA0002+ERJ2RKF7502X+7+WW; Supplier Part Number 1: P75.0KLCT-ND
R52 = ERJ-3EKF4701V: RES SMD 4.7K OHM 1% 1/10W 0603; Manufacturer: Panasonic Electronic Components; Power (Watts): 0.1W, 1/10W; Temperature Coefficient: ±100ppm/°C; Supplier 1: Digi-Key; Manufacturer Part Number: ERJ-3EKF4701V; RoHS: RoHS Compliant; Category: Resistors; Stock 1: 3227786; Pricing 1: 1=0.1, 50=0.0114, 100=0.0084, 250=0.00644, 500=0.00514, 1000=0.00379 (USD); Packaging: Cut Tape (CT); Tolerance: ±1%; Composition: Thick Film; Features: Automotive AEC-Q200; Operating Temperature: -55°C ~ 155°C; Package / Case: 0603 (1608 Metric); Supplier Device Package: 0603; Size / Dimension: 0.063" L x 0.031" W (1.60mm x 0.80mm); Height: 0.022" (0.55mm); Number of Terminations: 2; ComponentLink1URL: http://industrial.panasonic.com/www-cgi/jvcr13pz.cgi?E+PZ+3+AOA0002+ERJ3EKF4701V+7+WW; ComponentLink1Description: http://industrial.panasonic.com/www-cgi/jvcr13pz.cgi?E+PZ+3+AOA0002+ERJ3EKF4701V+7+WW; Supplier Part Number 1: P4.70KHCT-ND
R53 = RC0402FR-0710KL: RES SMD 10K OHM 1% 1/16W 0402; Manufacturer: Yageo; Power (Watts): 0.063W, 1/16W; Temperature Coefficient: ±100ppm/°C; Supplier 1: Digi-Key; Manufacturer Part Number: RC0402FR-0710KL; RoHS: RoHS Compliant; Category: Resistors; Stock 1: 6043320; Pricing 1: 1=0.1, 10=0.013, 25=0.0096, 100=0.0054, 250=0.00412, 500=0.00328, 1000=0.00242, 2500=0.0021, 5000=0.00173 (USD); Packaging: Cut Tape (CT); Tolerance: ±1%; Composition: Thick Film; Features: Moisture Resistant; Operating Temperature: -55°C ~ 155°C; Package / Case: 0402 (1005 Metric); Supplier Device Package: 0402; Size / Dimension: 0.039" L x 0.020" W (1.00mm x 0.50mm); Height: 0.016" (0.40mm); Number of Terminations: 2; ComponentLink1URL: http://www.yageo.com/NewPortal/yageodocoutput?fileName=/pdf/R-Chip/PYu-RC_Group_51_RoHS_L_3.pdf; ComponentLink1Description: http://www.yageo.com/NewPortal/yageodocoutput?fileName=/pdf/R-Chip/PYu-RC_Group_51_RoHS_L_3.pdf; Supplier Part Number 1: 311-10.0KLRCT-ND
R55 = ERA-2AEB1471X: RES SMD 1.47KOHM 0.1% 1/16W 0402; Manufacturer: Panasonic Electronic Components; Power (Watts): 0.063W, 1/16W; Temperature Coefficient: ±25ppm/°C; Supplier 1: Digi-Key; Manufacturer Part Number: ERA-2AEB1471X; RoHS: RoHS Compliant; Category: Resistors; Stock 1: 13079; Pricing 1: 1=0.6, 50=0.2484, 100=0.2052, 250=0.162, 500=0.13824, 1000=0.10368, 5000=0.07776 (USD); Packaging: Cut Tape (CT); Tolerance: ±0.1%; Composition: Thin Film; Features: Automotive AEC-Q200; Operating Temperature: -55°C ~ 155°C; Package / Case: 0402 (1005 Metric); Supplier Device Package: 0402; Size / Dimension: 0.039" L x 0.020" W (1.00mm x 0.50mm); Height: 0.016" (0.40mm); Number of Terminations: 2; ComponentLink1URL: http://media.digikey.com/pdf/Data%20Sheets/Panasonic%20Electronic%20Components/ERA%201A,2A,3A,6A,8A.pdf; ComponentLink1Description: http://media.digikey.com/pdf/Data%20Sheets/Panasonic%20Electronic%20Components/ERA%201A,2A,3A,6A,8A.pdf; Supplier Part Number 1: P1.47KDCCT-ND
R57 = CRCW04025K10FKED: RES SMD 5.1K OHM 1% 1/16W 0402; Manufacturer: Vishay Dale; Power (Watts): 0.063W, 1/16W; Temperature Coefficient: ±100ppm/°C; Supplier 1: Digi-Key; Manufacturer Part Number: CRCW04025K10FKED; RoHS: RoHS Compliant; Category: Resistors; Stock 1: 39664; Pricing 1: 10=0.083, 50=0.0444, 200=0.0255, 1000=0.0174 (USD); Packaging: Cut Tape (CT); Tolerance: ±1%; Composition: Thick Film; Features: Automotive AEC-Q200; Operating Temperature: -55°C ~ 155°C; Package / Case: 0402 (1005 Metric); Supplier Device Package: 0402 (1005 Metric); Size / Dimension: 0.039" L x 0.020" W (1.00mm x 0.50mm); Height: 0.016" (0.40mm); Number of Terminations: 2; ComponentLink1URL: http://www.vishay.com/docs/20035/dcrcwe3.pdf; ComponentLink1Description: http://www.vishay.com/docs/20035/dcrcwe3.pdf; Supplier Part Number 1: 541-5.10KLCT-ND
R58 = ERJ-2RKF2432X: RES SMD 24.3K OHM 1% 1/10W 0402; Manufacturer: Panasonic Electronic Components; Power (Watts): 0.1W, 1/10W; Temperature Coefficient: ±100ppm/°C; Supplier 1: Digi-Key; Manufacturer Part Number: ERJ-2RKF2432X; RoHS: RoHS Compliant; Category: Resistors; Stock 1: 241086; Pricing 1: 1=0.1, 50=0.015, 100=0.011, 250=0.0084, 500=0.00674, 1000=0.00496, 5000=0.00355 (USD); Packaging: Cut Tape (CT); Tolerance: ±1%; Composition: Thick Film; Features: Automotive AEC-Q200; Operating Temperature: -55°C ~ 155°C; Package / Case: 0402 (1005 Metric); Supplier Device Package: 0402; Size / Dimension: 0.039" L x 0.020" W (1.00mm x 0.50mm); Height: 0.016" (0.40mm); Number of Terminations: 2; ComponentLink1URL: http://industrial.panasonic.com/www-cgi/jvcr13pz.cgi?E+PZ+3+AOA0002+ERJ2RKF2432X+7+WW; ComponentLink1Description: http://industrial.panasonic.com/www-cgi/jvcr13pz.cgi?E+PZ+3+AOA0002+ERJ2RKF2432X+7+WW; Supplier Part Number 1: P24.3KLCT-ND
R59 = ERA-2AEB8062X: RES SMD 80.6KOHM 0.1% 1/16W 0402; Manufacturer: Panasonic Electronic Components; Power (Watts): 0.063W, 1/16W; Temperature Coefficient: ±25ppm/°C; Supplier 1: Digi-Key; Manufacturer Part Number: ERA-2AEB8062X; RoHS: RoHS Compliant; Category: Resistors; Stock 1: 11497; Pricing 1: 1=0.6, 50=0.2484, 100=0.2052, 250=0.162, 500=0.13824, 1000=0.10368, 5000=0.07776 (USD); Packaging: Cut Tape (CT); Tolerance: ±0.1%; Composition: Thin Film; Features: Automotive AEC-Q200; Operating Temperature: -55°C ~ 155°C; Package / Case: 0402 (1005 Metric); Supplier Device Package: 0402; Size / Dimension: 0.039" L x 0.020" W (1.00mm x 0.50mm); Height: 0.016" (0.40mm); Number of Terminations: 2; ComponentLink1URL: http://media.digikey.com/pdf/Data%20Sheets/Panasonic%20Electronic%20Components/ERA%201A,2A,3A,6A,8A.pdf; ComponentLink1Description: http://media.digikey.com/pdf/Data%20Sheets/Panasonic%20Electronic%20Components/ERA%201A,2A,3A,6A,8A.pdf; Supplier Part Number 1: P80.6KDCCT-ND
R60 R61 = ERJ-2RKF2493X: RES SMD 249K OHM 1% 1/10W 0402; Manufacturer: Panasonic Electronic Components; Power (Watts): 0.1W, 1/10W; Temperature Coefficient: ±100ppm/°C; Supplier 1: Digi-Key; Manufacturer Part Number: ERJ-2RKF2493X; RoHS: RoHS Compliant; Category: Resistors; Stock 1: 299269; Pricing 1: 1=0.1, 50=0.015, 100=0.011, 250=0.0084, 500=0.00674, 1000=0.00496, 5000=0.00355 (USD); Packaging: Cut Tape (CT); Tolerance: ±1%; Composition: Thick Film; Features: Automotive AEC-Q200; Operating Temperature: -55°C ~ 155°C; Package / Case: 0402 (1005 Metric); Supplier Device Package: 0402; Size / Dimension: 0.039" L x 0.020" W (1.00mm x 0.50mm); Height: 0.016" (0.40mm); Number of Terminations: 2; ComponentLink1URL: http://industrial.panasonic.com/www-cgi/jvcr13pz.cgi?E+PZ+3+AOA0002+ERJ2RKF2493X+7+WW; ComponentLink1Description: http://industrial.panasonic.com/www-cgi/jvcr13pz.cgi?E+PZ+3+AOA0002+ERJ2RKF2493X+7+WW; Supplier Part Number 1: P249KLCT-ND
SW1 = 7101J1V3QE2: SWITCH ROCKER SPDT 5A 120V; Manufacturer: C&K Components; Switch Function: On-On; Current Rating: 5A (AC/DC); Voltage Rating - DC: 28V; Actuator Type: Concave (Standard V); Color - Actuator/Cap: Black; Actuator Marking: No Marking; Electrical Life: 100,000 Cycles; Supplier 1: Digi-Key; Manufacturer Part Number: 7101J1V3QE2; RoHS: RoHS Compliant; Category: Switches; Stock 1: 548; Pricing 1: 1=7.24, 10=6.715, 50=6.2728, 100=6.1845, 250=6.0078, 500=5.4777, 1000=4.9476, 5000=4.68255 (USD); Packaging: Bulk; Circuit: SPDT; Voltage Rating - AC: 120V; Illumination Type, Color: -; Illumination Voltage (Nominal): -; Mounting Type: Through Hole; Termination Style: PC Pin; Ingress Protection: -; Features: Epoxy Sealed Terminals; Panel Cutout Dimensions: -; Operating Temperature: -30°C ~ 85°C; Mechanical Life: -; ComponentLink1URL: http://www.ck-components.com/15114/7000rockers; ComponentLink1Description: http://www.ck-components.com/15114/7000rockers; Supplier Part Number 1: CKN2013-ND
U2 = LMZ12002TZ-ADJ/NOPB: IC BUCK SYNC ADJ 2A TO-PMOD-7; Manufacturer: Texas Instruments; Number of Outputs: 1; Voltage - Input (Min): 4.5V; Voltage - Input (Max): 20V; Voltage - Output 1: 0.8 ~ 6 V; Efficiency: 92%; Supplier 1: Digi-Key; Manufacturer Part Number: LMZ12002TZ-ADJ/NOPB; RoHS: RoHS Compliant; Category: Power Supplies - Board Mount; Stock 1: 1050; Pricing 1: 1=8.54, 5=8.474, 10=8.412, 25=8.2864, 50=8.0352, 100=7.2819 (USD); Packaging: Cut Tape (CT); Type: Non-Isolated PoL Module; Voltage - Output 2: -; Voltage - Output 3: -; Current - Output (Max): 2A; Power (Watts) - Manufacture Series: -; Voltage - Isolation: -; Applications: ITE (Commercial); Features: With UVLO; Mounting Type: Surface Mount; Package / Case: TO-PMOD-7, Power Module; Size / Dimension: 0.40" L x 0.54" W x 0.18" H (10.2mm x 13.8mm x 4.6mm); Operating Temperature: -40°C ~ 125°C; Power (Watts) - Max: -; ComponentLink1URL: http://www.ti.com/lit/ds/symlink/lmz12002.pdf; ComponentLink1Description: http://www.ti.com/lit/ds/symlink/lmz12002.pdf; Supplier Part Number 1: LMZ12002TZ-ADJ/NOPBCT-ND
U3 U6 = IRF7832TRPBF: MOSFET N-CH 30V 20A 8-SOIC; Manufacturer: Infineon Technologies Americas Corp.; FET Type: MOSFET N-Channel, Metal Oxide; FET Feature: Standard; Current - Continuous Drain (Id) @ 25°C: 20A (Ta); Rds On (Max) @ Id, Vgs: 4 mOhm @ 20A, 10V; Vgs(th) (Max) @ Id: 2.32V @ 250µA; Gate Charge (Qg) @ Vgs: 51nC @ 4.5V; Input Capacitance (Ciss) @ Vds: 4310pF @ 15V; Power - Max: 2.5W; Supplier 1: Digi-Key; Manufacturer Part Number: IRF7832TRPBF; RoHS: RoHS Compliant; Category: Discrete Semiconductor Products; Stock 1: 4672; Pricing 1: 1=1.59, 10=1.42, 100=1.1068, 500=0.91532, 1000=0.72385 (USD); Packaging: Cut Tape (CT); Drain to Source Voltage (Vdss): 30V; Operating Temperature: -55°C ~ 155°C (TJ); Mounting Type: Surface Mount; Package / Case: 8-SOIC (0.154", 3.90mm Width); Supplier Device Package: 8-SO; ComponentLink1URL: http://www.irf.com/product-info/datasheets/data/irf7832pbf.pdf; ComponentLink1Description: http://www.irf.com/product-info/datasheets/data/irf7832pbf.pdf; Supplier Part Number 1: IRF7832PBFCT-ND
U4 = TPS54610PWPR: IC REG BUCK ADJ 6A SYNC 28HTSSOP; Manufacturer: Texas Instruments; Function: Step-Down; Output Configuration: Positive; Output Type: Adjustable; Number of Outputs: 1; Voltage - Input (Min): 3V; Voltage - Input (Max): 6V; Voltage - Output (Min/Fixed): 0.891V; Voltage - Output (Max): 5.4V; Frequency - Switching: 350kHz, 550kHz; Synchronous Rectifier: Yes; Supplier 1: Digi-Key; Manufacturer Part Number: TPS54610PWPR; RoHS: RoHS Compliant; Category: Integrated Circuits (ICs); Stock 1: 3948; Pricing 1: 1=6.84, 10=6.194, 100=5.1057, 500=4.464, 1000=3.4875 (USD); Packaging: Cut Tape (CT); Topology: Buck; Current - Output: 6A; Operating Temperature: -40°C ~ 85°C (TA); Mounting Type: Surface Mount; Package / Case: 28-TSSOP (0.173", 4.40mm Width) Exposed Pad; Supplier Device Package: 28-HTSSOP; ComponentLink1URL: http://www.ti.com/lit/ds/symlink/tps54610.pdf; ComponentLink1Description: http://www.ti.com/lit/ds/symlink/tps54610.pdf; Supplier Part Number 1: 296-26998-1-ND
U5 = TPS51116PWPR: IC DDR SYNC BUC CTRL REF20HTSSOP; Manufacturer: Texas Instruments; Voltage - Input: 3 V ~ 28 V; Number of Outputs: 1; Voltage - Output: 1.5V, 1.8V, 2.5V; Supplier 1: Digi-Key; Manufacturer Part Number: TPS51116PWPR; RoHS: RoHS Compliant; Category: Integrated Circuits (ICs); Stock 1: 935; Pricing 1: 1=3.02, 10=2.711, 100=2.1747, 500=1.7874, 1000=1.24125 (USD); Packaging: Cut Tape (CT); Applications: Controller, DDR; Operating Temperature: -40°C ~ 85°C; Mounting Type: Surface Mount; Package / Case: 20-TSSOP (0.173", 4.40mm Width) Exposed Pad; Supplier Device Package: 20-HTSSOP; ComponentLink1URL: http://www.ti.com/lit/ds/symlink/tps51116.pdf; ComponentLink1Description: http://www.ti.com/lit/ds/symlink/tps51116.pdf; Supplier Part Number 1: 296-26972-1-ND
U7 = TPS76725QPWPREP: IC REG LDO 2.5V 1A 20HTSSOP; Manufacturer: Texas Instruments; Regulator Topology: Positive Fixed; Number of Regulators: 1; Voltage - Input: 2.7 V ~ 10 V; Supplier 1: Digi-Key; Manufacturer Part Number: TPS76725QPWPREP; RoHS: RoHS non-compliant; Category: Integrated Circuits (ICs); Stock 1: 1442; Pricing 1: 1=3.69, 10=3.308, 100=2.7135, 500=2.3085, 1000=1.6875 (USD); Packaging: Cut Tape (CT); Voltage - Output: 2.5V; Current - Output: 1A; Voltage - Dropout (Typical): -; Current - Limit (Min): -; Operating Temperature: -40°C ~ 125°C; Mounting Type: Surface Mount; Package / Case: 20-TSSOP (0.173", 4.40mm Width) Exposed Pad; Supplier Device Package: 20-HTSSOP; ComponentLink1URL: http://www.ti.com/lit/ds/symlink/tps76715-ep.pdf; ComponentLink1Description: http://www.ti.com/lit/ds/symlink/tps76715-ep.pdf; Supplier Part Number 1: 296-18157-1-ND
U8 = LM3940IMPX-3.3/NOPB: IC REG LDO 3.3V 1A SOT223; Manufacturer: Texas Instruments; Regulator Topology: Positive Fixed; Voltage - Dropout (Typical): 0.5V @ 1A; Number of Regulators: 1; Voltage - Input: Up to 7.5V; Supplier 1: Digi-Key; Manufacturer Part Number: LM3940IMPX-3.3/NOPB; RoHS: RoHS Compliant; Category: Integrated Circuits (ICs); Stock 1: 15650; Pricing 1: 1=1.49, 10=1.332, 100=1.0381, 500=0.85848, 1000=0.6789 (USD); Packaging: Cut Tape (CT); Voltage - Output: 3.3V; Current - Output: 1A; Current - Limit (Min): -; Operating Temperature: -40°C ~ 125°C; Mounting Type: Surface Mount; Package / Case: TO-261-4, TO-261AA; Supplier Device Package: SOT-223-4; ComponentLink1URL: http://www.ti.com/lit/ds/symlink/lm3940.pdf; ComponentLink1Description: http://www.ti.com/lit/ds/symlink/lm3940.pdf; Supplier Part Number 1: LM3940IMPX-3.3/NOPBCT-ND
U9 = TPS76718QPWPR: IC REG LDO 1.8V 1A 20HTSSOP; Manufacturer: Texas Instruments; Regulator Topology: Positive Fixed; Number of Regulators: 1; Voltage - Input: 2.7 V ~ 10 V; Current - Limit (Min): 1.2A; Supplier 1: Digi-Key; Manufacturer Part Number: TPS76718QPWPR; RoHS: RoHS Compliant; Category: Integrated Circuits (ICs); Stock 1: 779; Pricing 1: 1=3.1, 10=2.778, 100=2.2793, 500=1.93914, 1000=1.4175 (USD); Packaging: Cut Tape (CT); Voltage - Output: 1.8V; Current - Output: 1A; Voltage - Dropout (Typical): -; Operating Temperature: -40°C ~ 125°C; Mounting Type: Surface Mount; Package / Case: 20-TSSOP (0.173", 4.40mm Width) Exposed Pad; Supplier Device Package: 20-HTSSOP; ComponentLink1URL: http://www.ti.com/lit/ds/symlink/tps76701.pdf; ComponentLink1Description: http://www.ti.com/lit/ds/symlink/tps76701.pdf; Supplier Part Number 1: 296-37450-1-ND